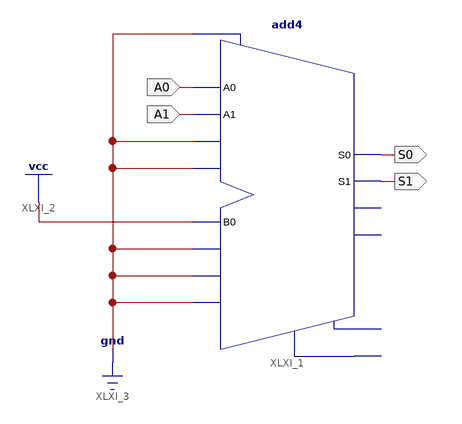
[diagram p0: schematic sheet 1]
// Xilinx ISE schematic add1.sch (spartan6) as structural Verilog: 1 symbols, 4 ports
module add1 (
  input  A0,
  input  A1,
  output S0,
  output S1
);

  add4 XLXI_1 (
    .A0(A0), .A1(A1), .A2(1'b0), .A3(1'b0), .B0(1'b1), .B1(1'b0), .B2(1'b0), .B3(1'b0), .CI(1'b0), .S0(S0),
    .S1(S1));  // open: CO, OFL, S2, S3
endmodule
